# Altium schematic sheet MCU.SchDoc
size 304 x 241 mm
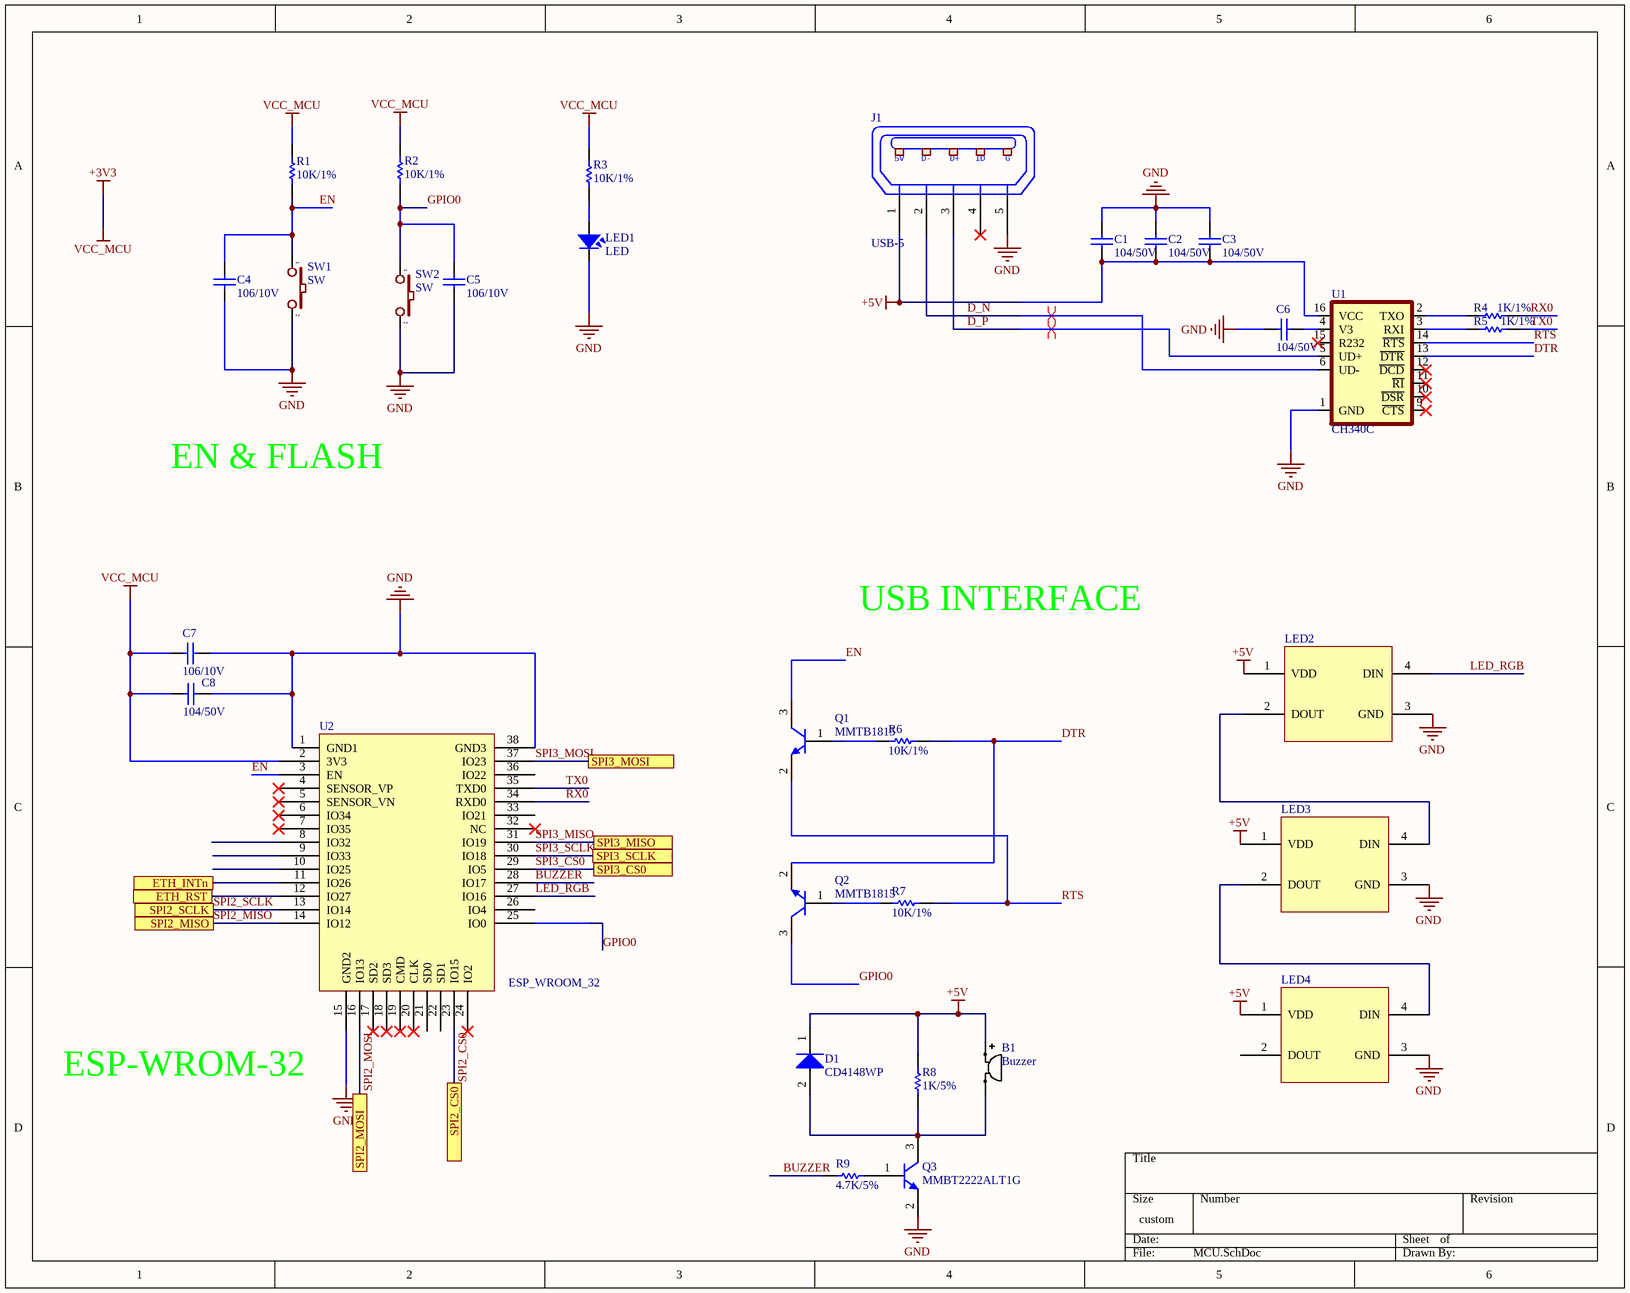
[diagram p0: MCU.SchDoc]

## Parts
B1  Buzzer  [PS1240P02BT]
C1  104/50V  [C0603-B]
C2  104/50V  [C0603-B]
C3  104/50V  [C0603-B]
C4  106/10V  [C0603-B]
C5  106/10V  [C0603-B]
C6  104/50V  [C0603-B]
C7  106/10V  [C0603-B]
C8  104/50V  [C0603-B]
D1  CD4148WP  [D1206-C]
J1  USB-5  [USB-M1]
LED1  LED  [LED-0805-Red]
LED2  RGB 4 Pin WS2812B  [WS2812B]  (value not drawn)
LED3  RGB 4 Pin WS2812B  [WS2812B]  (value not drawn)
LED4  RGB 4 Pin WS2812B  [WS2812B]  (value not drawn)
Q1  MMTB1815  [SOT23-321-C]
Q2  MMTB1815  [SOT23-321-C]
Q3  MMBT2222ALT1G  [SOT23-321-B]
R1  10K/1%  [R0603-B]
R2  10K/1%  [R0603-B]
R3  10K/1%  [R0603-B]
R4  1K/1%  [R0603-B]
R5  1K/1%  [R0603-B]
R6  10K/1%  [R0603-B]
R7  10K/1%  [R0603-B]
R8  1K/5%  [R0603-B]
R9  4.7K/5%  [R0603-B]
SW1  SW  [SW2 - 3x4x2.5]
SW2  SW  [SW2 - 3x4x2.5]
U1  CH340C  [SO016]
U2  ESP_WROOM_32  [ESP32_WROOM_32]

## Ports
ETH_INTn, ETH_RST, SPI2_CS0, SPI2_MISO, SPI2_MOSI, SPI2_SCLK, SPI3_CS0, SPI3_MISO, SPI3_MOSI, SPI3_SCLK

## Nets
+3V3: C7.2 C8.2 R1.2 R2.2 R3.2 U2.2(3V3)  [also labelled VCC_MCU]
+5V: B1.1 C1.1 C2.1 C3.1 D1.1(K) J1.1(P1) LED2.1(VDD) LED3.1(VDD) LED4.1(VDD) R8.2 U1.16(VCC)
GND: C1.2 C2.2 C3.2 C4.1 C5.1 C6.2 C7.1 C8.1 J1.5(P5) LED1.2 LED2.3(GND) LED3.3(GND) LED4.3(GND) Q3.2(E) SW1.2 SW2.2 U1.1(GND) U2.1(GND1) U2.15(GND2) U2.38(GND3)
BUZZER: R9.1 U2.28(IO17)
D_N: J1.2(P2) U1.6(UD-)
D_P: J1.3(P3) U1.5(UD+)
DTR: Q2.2(E) R6.2 U1.13(~{DTR})
EN: C4.2 Q1.3(C) R1.1 SW1.1 U2.3(EN)
ETH_INTn: U2.11(IO26) ; port ETH_INTn
ETH_RST: U2.12(IO27) ; port ETH_RST
GPIO0: C5.2 Q2.3(C) R2.1 SW2.1 U2.25(IO0)
LED_RGB: LED2.4(DIN) U2.27(IO16)
RTS: Q1.2(E) R7.2 U1.14(~{RTS})
RX0: R4.2 U2.34(RXD0)
SPI2_CS0: U2.23(IO15) ; port SPI2_CS0
SPI2_MISO: U2.14(IO12) ; port SPI2_MISO
SPI2_MOSI: U2.16(IO13) ; port SPI2_MOSI
SPI2_SCLK: U2.13(IO14) ; port SPI2_SCLK
SPI3_CS0: U2.29(IO5) ; port SPI3_CS0
SPI3_MISO: U2.31(IO19) ; port SPI3_MISO
SPI3_MOSI: U2.37(IO23) ; port SPI3_MOSI
SPI3_SCLK: U2.30(IO18) ; port SPI3_SCLK
TX0: R5.2 U2.35(TXD0)
NetB1_2: B1.2 D1.2(A) Q3.3(C) R8.1
NetC6_1: C6.1 U1.4(V3)
NetLED1_1: LED1.1 R3.1
NetLED2_2: LED2.2(DOUT) LED3.4(DIN)
NetLED3_2: LED3.2(DOUT) LED4.4(DIN)
NetQ1_1: Q1.1(B) R6.1
NetQ2_1: Q2.1(B) R7.1
NetQ3_1: Q3.1(B) R9.2
NetR4_1: R4.1 U1.2(TXO)
NetR5_1: R5.1 U1.3(RXI)

Not connected (* = marked no-connect by the designer): J1 4(P4)*; LED4 2(DOUT); U1 9(~{CTS})* 10(~{DSR})* 11(~{RI})* 12(~{DCD})* 15(R232)*; U2 4(SENSOR_VP)* 5(SENSOR_VN)* 6(IO34)* 7(IO35)* 8(IO32) 9(IO33) 10(IO25) 17(SD2)* 18(SD3)* 19(CMD)* 20(CLK)* 21(SD0) 22(SD1) 24(IO2)* 26(IO4) 32(NC)* 33(IO21) 36(IO22)

## Layout directives
differential pair: D_N, D_P

## Notes on the sheet
- EN & FLASH
- USB INTERFACE
- ESP-WROM-32
- (in symbol USB-5) 5V; D-; D+; ID; G

## Library data of the parts
B1 = PS1240P02BT: Audio Indicators & Alerts Round 12.2mmx6.5mm 4kHz Vin=3V; BSH Partnumber: New part; Manufacture: TDK; Pricing (USD): 0.78; Partnumber: PS1240P02BT; Distributor: Digikey; Value: Buzzer; Creator: NamNHc; Date: 20170410; ComponentLink1Description: Datasheet; ComponentLink1URL: https://product.tdk.com/info/en/catalog/datasheets/ef532_ps.pdf; Datasheet: https://product.tdk.com/info/en/catalog/datasheets/ef532_ps.pdf; ComponentLink2Description: Link sale; ComponentLink2URL: https://www.digikey.com/product-detail/en/tdk-corporation/PS1240P02BT/445-2525-3-ND/935924; Link sale: https://www.digikey.com/product-detail/en/tdk-corporation/PS1240P02BT/445-2525-3-ND/935924
C1-C3 C6 C8 = CL10B104KB8NNNC: 100nF ±10% 50V X7R 0603 Multilayer Ceramic Capacitors MLCC - SMD/SMT RoHS; BSH Partnumber: C1591; Manufacture: Samsung Electro-Mechanics; Pricing (USD): 0.008; Partnumber: CL10B104KB8NNNC; Distributor: LCSC Electronics; Value: 104/50V; Creator: Digo; Date: 20210218; ComponentLink1Description: Datasheet; ComponentLink1URL: https://datasheet.lcsc.com/szlcsc/1811021431_Samsung-Electro-Mechanics-CL10B104KB8NNNC_C1591.pdf; Datasheet: https://datasheet.lcsc.com/szlcsc/1811021431_Samsung-Electro-Mechanics-CL10B104KB8NNNC_C1591.pdf; ComponentLink2Description: Link sale; ComponentLink2URL: https://item.szlcsc.com/1943.html; Link sale: https://item.szlcsc.com/1943.html
C4 C5 C7 = CL10A106KP8NNNC: 10uF ±10% 10V X5R 0603 Multilayer Ceramic Capacitors MLCC - SMD/SMT RoHS; BSH Partnumber: C19702; Manufacture: Samsung Electro-Mechanics; Pricing (USD): 0.008; Partnumber: CL10A106KP8NNNC; Distributor: LCSC Electronics; Value: 106/10V; Creator: Digo; Date: 20210219; ComponentLink1Description: Datasheet; ComponentLink1URL: https://datasheet.lcsc.com/szlcsc/1810191219_Samsung-Electro-Mechanics-CL10A106KP8NNNC_C19702.pdf; Datasheet: https://datasheet.lcsc.com/szlcsc/1810191219_Samsung-Electro-Mechanics-CL10A106KP8NNNC_C19702.pdf; ComponentLink2Description: Link sale; ComponentLink2URL: https://item.szlcsc.com/20411.html; Link sale: https://item.szlcsc.com/20411.html
D1 = CD4148WP: DIO D1206 150mA 75V Switching Chip Diode; BSH Partnumber: D-CD4148WP; Manufacture: Mayloon electronic; Pricing (USD): 0.029; Partnumber: CD4148WP; Value: CD4148WP; Creator: ChienNQ; Date: 20150818; ComponentLink1Description: Datasheet; ComponentLink1URL: http://www.mouser.com/ds/2/115/ds18004-73542.pdf; Datasheet: http://www.mouser.com/ds/2/115/ds18004-73542.pdf; ComponentLink2Description: Link sale; ComponentLink2URL: http://tme.vn/Product.aspx?id=1848; Link sale: http://tme.vn/Product.aspx?id=1848
J1 = USB-5: Manufacturer: FCI; Manufacturer Part Number: 10118193-0001LF; Connector Type: USB - micro B; Number of Contacts: 5; Gender: Receptacle; Specifications: USB 2.0; .Creator: MM; .Checked PCB: RF; Supplier 1: Digi-Key; RoHS: RoHS Compliant; Category: Connectors, Interconnects; Stock 1: 28642; Pricing 1: 1=0.46, 10=0.433, 25=0.3712, 50=0.3156, 100=0.3032, 250=0.27224, 500=0.25988 (USD); Packaging: Cut Tape (CT); Mounting Type: Surface Mount, Right Angle, Horizontal; Features: Shielded, Solder Retention; Ingress Protection: -; ComponentLink1URL: http://portal.fciconnect.com/Comergent//fci/drawing/10118193.pdf; ComponentLink1Description: http://portal.fciconnect.com/Comergent//fci/drawing/10118193.pdf; Supplier Part Number 1: 609-4616-1-ND; .Checked SCH: MM
LED1 = LED: LED Single colour Green and Red; Value: LED 3 ly Single Colour
LED2-LED4 = WS2812B: Intelligent control LED / integrated light source
Q1 Q2 = MMTB1815: Transistor NPN SOT23 MMTB1815 Pitch_0.90 mm 2.92x2.00x1.11 mm; BSH Partnumber: Q-MMBT1815-TP; Manufacture: Toshiba; Pricing (USD): 0.025; Partnumber: MMTB1815; Value: MMTB1815; Creator: DucNTc; Date: 20150912; ComponentLink1Description: Datasheet; ComponentLink1URL: http://www.cnelectr.net/diodes/pdf/mmbt1815.pdf; Datasheet: http://www.cnelectr.net/diodes/pdf/mmbt1815.pdf; ComponentLink2Description: Link sale; ComponentLink2URL: http://www.tme.vn/Product.aspx?id=413; Link sale: http://www.tme.vn/Product.aspx?id=413
Q3 = MMBT2222ALT1G: Transistor NPN SOT23 MMBT2222A Pitch_0.90 mm 2.92x2.00x1.11mm; BSH Partnumber: Q-MMBT2222A; Manufacture: Fairchild Semiconductor; Pricing (USD): 0.02; Partnumber: MMBT2222ALT1G; Distributor: Mouser; Value: MMBT2222ALT1G; Creator: SmartDevice; Date: 20150923; ComponentLink1Description: Datasheet; ComponentLink1URL: http://www.mouser.com/ds/2/308/MMBT2222LT1-D-80103.pdf; Datasheet: http://www.mouser.com/ds/2/308/MMBT2222LT1-D-80103.pdf; ComponentLink2Description: Link sale; ComponentLink2URL: http://www.mouser.vn/ProductDetail/ON-Semiconductor/MMBT2222ALT1G/?qs=sGAEpiMZZMutXGli8Ay4kC402l06AIhPIMD2ii7BaQ0%3d; Link sale: http://www.mouser.vn/ProductDetail/ON-Semiconductor/MMBT2222ALT1G/?qs=sGAEpiMZZMutXGli8Ay4kC402l06AIhPIMD2ii7BaQ0%3d
R1-R3 R6 R7 = RC0603FR-0710KL: RES 0603 10K 1% 100mW; BSH Partnumber: C98220; Manufacture: Yageo; Pricing (USD): 0.002; Partnumber: RC0603FR-0710KL; Distributor: LCSC Electronics; Value: 10K/1%; Creator: Digo; Date: 20181029; ComponentLink1Description: Datasheet; ComponentLink1URL: https://datasheet.lcsc.com/lcsc/1811101934_YAGEO-RC0603FR-0710KL_C98220.pdf; Datasheet: https://datasheet.lcsc.com/lcsc/1811101934_YAGEO-RC0603FR-0710KL_C98220.pdf; ComponentLink2Description: Link sale; ComponentLink2URL: https://item.szlcsc.com/99429.html; Link sale: https://item.szlcsc.com/99429.html
R4 R5 = RC0603FR-071KL: RES 0603 1K 1% 100mW; BSH Partnumber: R-1k-0603-1; Manufacture: Yageo; Pricing (USD): 0.002; Partnumber: RC0603FR-071KL; Distributor: Mouser; Value: 1K/1%; Creator: SmartDevice; Date: 20150818; ComponentLink1Description: Datasheet; ComponentLink1URL: http://www.mouser.com/ds/2/447/RC0603-272842.pdf; Datasheet: http://www.mouser.com/ds/2/447/RC0603-272842.pdf; ComponentLink2Description: Link sale; ComponentLink2URL: http://vn.mouser.com/ProductDetail/Yageo/RC0603FR-071KL/?qs=%2fha2pyFaduhXXNW8qwNUNqQ9kEEY7HXXvpzZHS3Y0h%2feQEDxZMSpaQ%3d%3d; Link sale: http://vn.mouser.com/ProductDetail/Yageo/RC0603FR-071KL/?qs=%2fha2pyFaduhXXNW8qwNUNqQ9kEEY7HXXvpzZHS3Y0h%2feQEDxZMSpaQ%3d%3d
R8 = RC0603JR-071KL: RES 0603 1K 5% 100mW; BSH Partnumber: R-1K-0603-5; Manufacture: Yageo; Pricing (USD): 0.002; Partnumber: RC0603JR-071KL; Distributor: Mouser; Value: 1K/5%; Creator: SmartDevice; Date: 20160721; ComponentLink1Description: Datasheet; ComponentLink1URL: http://www.mouser.com/ds/2/447/RC0603-272842.pdf; Datasheet: http://www.mouser.com/ds/2/447/RC0603-272842.pdf; ComponentLink2Description: Link sale; ComponentLink2URL: http://www.mouser.vn/ProductDetail/Yageo/RC0603JR-071KL/?qs=%2fha2pyFaduiI%252b%2f%2fp%2fYhTTYiezRJ8nHxshEHwOaiSZf9t3tyz6IYSbg%3d%3d; Link sale: http://www.mouser.vn/ProductDetail/Yageo/RC0603JR-071KL/?qs=%2fha2pyFaduiI%252b%2f%2fp%2fYhTTYiezRJ8nHxshEHwOaiSZf9t3tyz6IYSbg%3d%3d
R9 = RC0603JR-074K7L: RES 0603 4K7 5% 100mW; BSH Partnumber: R-4K7-0603-5; Manufacture: Yageo; Pricing (USD): 0.002; Partnumber: RC0603JR-074K7L; Distributor: Mouser; Value: 4.7K/5%; Creator: SmartDevice; Date: 20150818; ComponentLink1Description: Datasheet; ComponentLink1URL: http://www.mouser.com/ds/2/447/RC0603-272842.pdf; Datasheet: http://www.mouser.com/ds/2/447/RC0603-272842.pdf; ComponentLink2Description: Link sale; ComponentLink2URL: http://vn.mouser.com/ProductDetail/Yageo/RC0603JR-074K7L/?qs=sGAEpiMZZMu61qfTUdNhG5eFuApKbqVdnRFv6b%2fvKA4%3d; Link sale: http://vn.mouser.com/ProductDetail/Yageo/RC0603JR-074K7L/?qs=sGAEpiMZZMu61qfTUdNhG5eFuApKbqVdnRFv6b%2fvKA4%3d
SW1 SW2 = SW2: Switch button 2 pin; Value: SW chip 2 pin
U1 = CH340C: USB to serial chip CH340; MF: WCH; Package: Package; Check_prices: https://www.snapeda.com/parts/CH340C/WCH/view-part/5428851/?ref=eda; Value: *; Price: None; MP: CH340C; Availability: Unavailable; SnapEDA_Link: https://www.snapeda.com/parts/CH340C/WCH/view-part/5428851/?ref=snap; ComponentLink1Description: https://shopee.vn/10-Ic-Ch340C-Ch340-Sop-16-Ic-Ch%E1%BA%A5t-L%C6%B0%E1%BB%A3ng-Cao-i.354017206.3568923182?gclid=CjwKCAjwgviIBhBkEiwA10D2jxg9RuL2f9hWoYHeo_FSM6pspJ3WHd-aH4B39ByWSgvqeA63UJxyaRoCPFwQAvD_BwE; ComponentLink1URL: https://shopee.vn/10-Ic-Ch340C-Ch340-Sop-16-Ic-Ch%E1%BA%A5t-L%C6%B0%E1%BB%A3ng-Cao-i.354017206.3568923182?gclid=CjwKCAjwgviIBhBkEiwA10D2jxg9RuL2f9hWoYHeo_FSM6pspJ3WHd-aH4B39ByWSgvqeA63UJxyaRoCPFwQAvD_BwE; ComponentLink2Description: https://shopee.vn/IC-giao-ti%E1%BA%BFp-USB-UART-CH340C-i.211729822.6315362497; ComponentLink2URL: https://shopee.vn/IC-giao-ti%E1%BA%BFp-USB-UART-CH340C-i.211729822.6315362497
U2 = ESP_WROOM_32: Manufacturer: Espressif Systems; Manufacturer Part Number: ESP32-WROOM-32E(4MBHIGHTEMP); Supplier 1: Digi-Key; Stock 1: 0; Pricing 1: 1=3.15 (USD); Supplier Part Number 1: 1965-ESP32-WROOM-32E(4MBHIGHTEMP)CT-ND; ComponentLink1Description: https://banlinhkien.vn/goods-9735-esp32-wroom-32-esp32-soc-chinh-hang.html; ComponentLink1URL: https://banlinhkien.vn/goods-9735-esp32-wroom-32-esp32-soc-chinh-hang.html